# EAGLE schematic V01 (EAGLE 8.0.0)
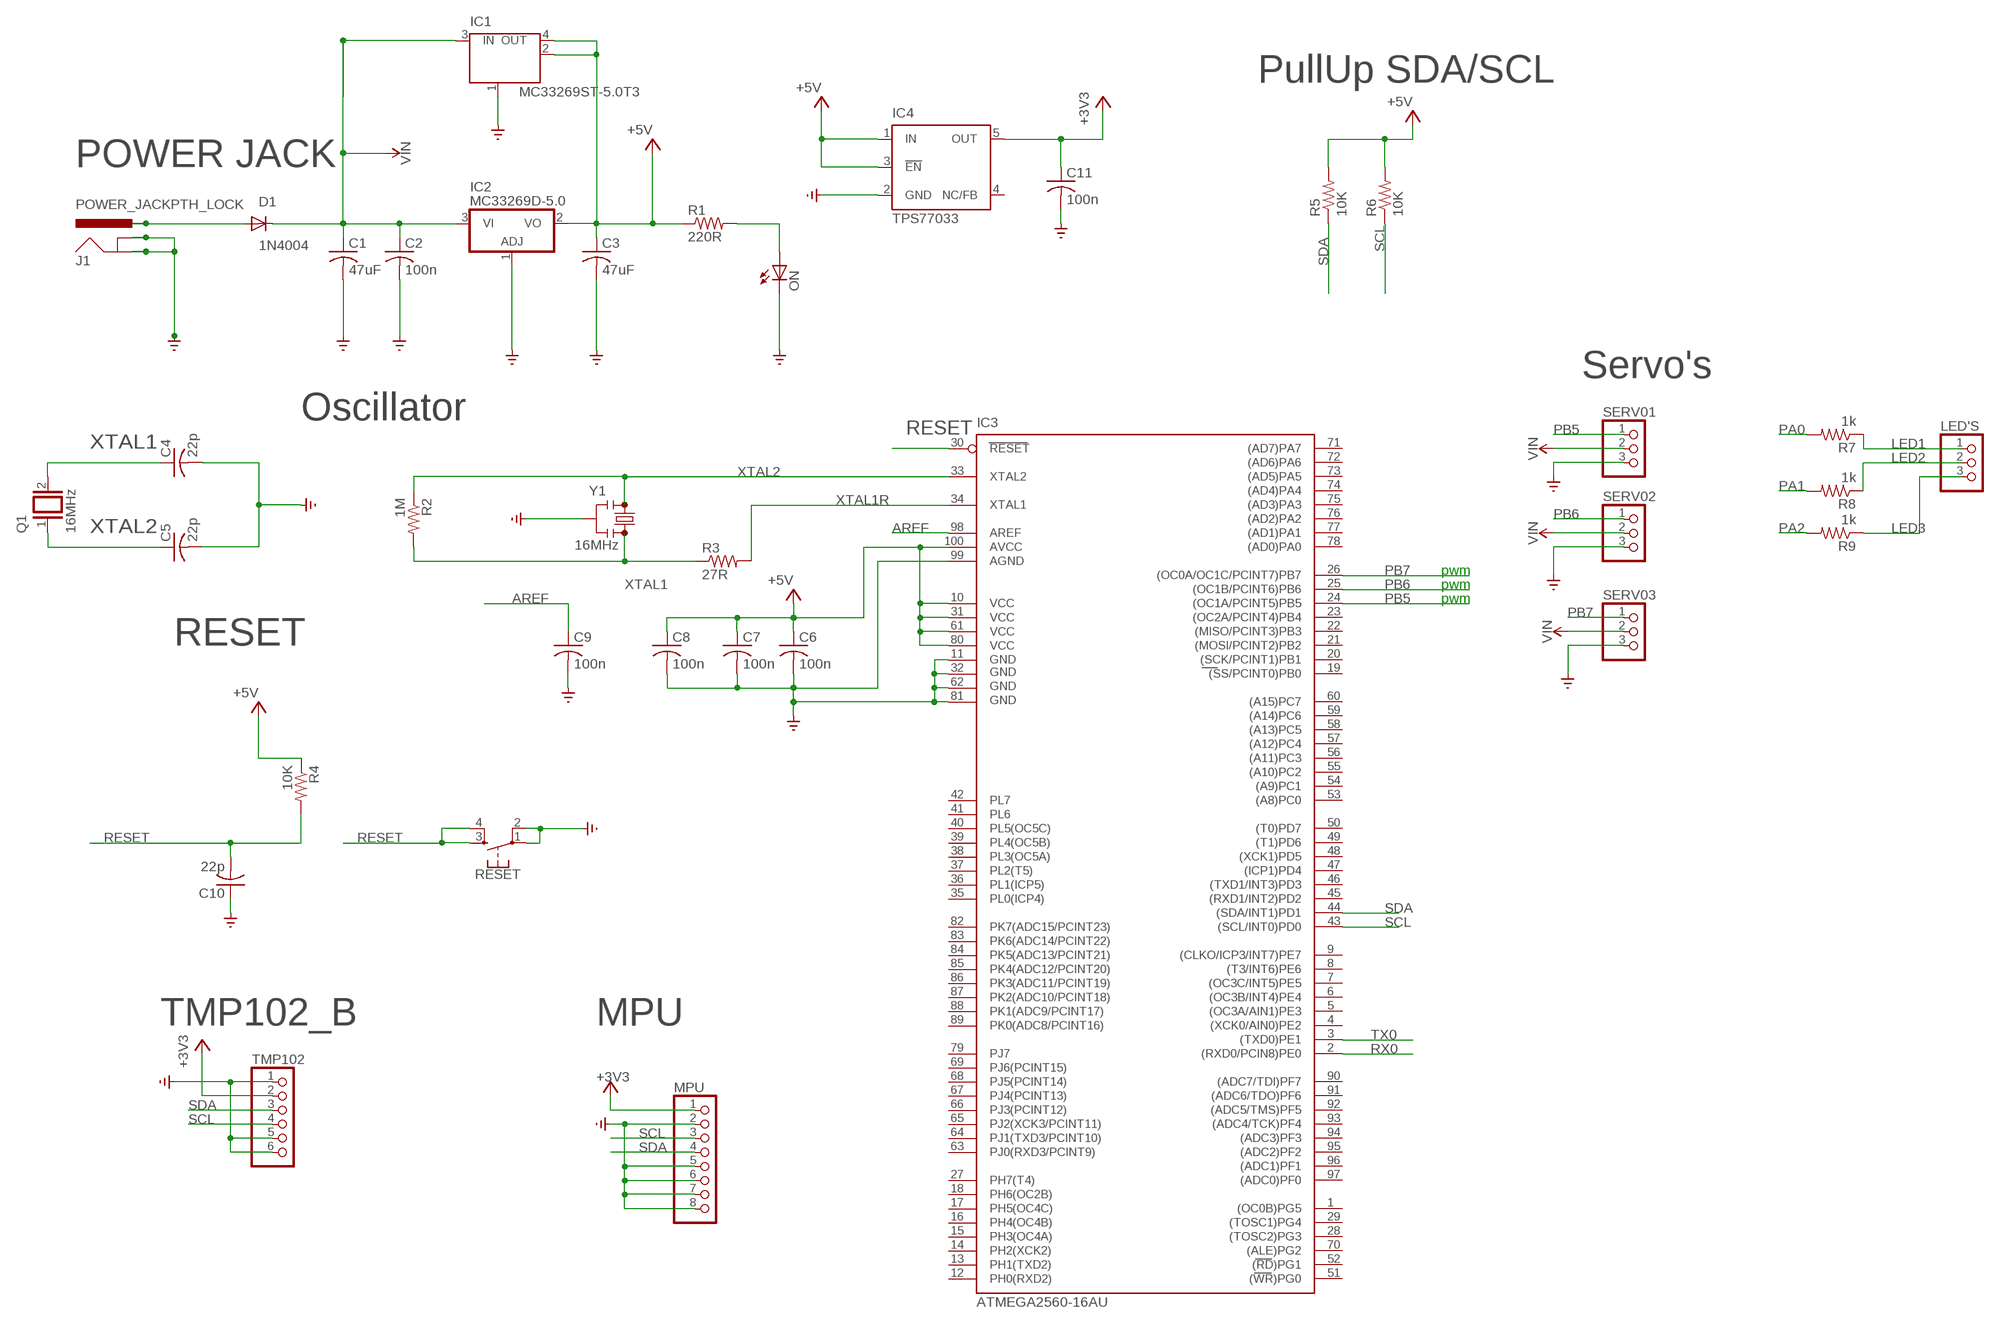
[diagram p0: schematic, sheet 1]

## Parts
C1  47uF  C-US025-024X044  [C025-024X044]
C2  100n  C-US025-024X044  [C025-024X044]
C3  47uF  C-US025-024X044  [C025-024X044]
C4  22p  C-US025-024X044  [C025-024X044]
C5  22p  C-US025-024X044  [C025-024X044]
C6  100n  C-US025-024X044  [C025-024X044]
C7  100n  C-US025-024X044  [C025-024X044]
C8  100n  C-US025-024X044  [C025-024X044]
C9  100n  C-US025-024X044  [C025-024X044]
C10  22p  C-US025-024X044  [C025-024X044]
C11  100n  C-US025-024X044  [C025-024X044]
D1  1N4004  [DO41-10]
IC1  MC33269ST-5.0T3  MC33269ST-3.3T3  [SOT223]
IC2  MC33269D-5.0  [DPACK]
IC3  ATMEGA2560-16AU  [TQFP100]
IC4  TPS77033  [SOT23-DBV]
J1  POWER_JACKPTH_LOCK  [POWER_JACK_PTH_LOCK]
LED'S  PINHD-1X3  [1X03]
MPU  PINHD-1X8  [1X08]
ON  LED3MM  [LED3MM]
Q1  16MHz  XTAL/S  [QS]
R1  220R  R-US_0204/2V  [0204V]
R2  1M  R-US_0204/2V  [0204V]
R3  27R  R-US_0204/2V  [0204V]
R4  10K  R-US_0204/2V  [0204V]
R5  10K  R-US_0204/2V  [0204V]
R6  10K  R-US_0204/2V  [0204V]
R7  1k  R-US_0204/2V  [0204V]
R8  1k  R-US_0204/2V  [0204V]
R9  1k  R-US_0204/2V  [0204V]
RESET  MOMENTARY-SWITCH-SPST-2-SMD-5.2MM  [TACTILE_SWITCH_SMD_5.2MM]
SERV01  PINHD-1X3  [1X03]
SERV02  PINHD-1X3  [1X03]
SERV03  PINHD-1X3  [1X03]
TMP102  PINHD-1X6  [1X06]
Y1  16MHz  RESONATORSMD-3.2X1.3  [RESONATOR-SMD-3.2X1.3]

## Nets
+3V3: C11.1 IC4.5(OUT) MPU.1 TMP102.2
+5V: C3.1 C6.1 C7.1 C8.1 IC1.2(OUT) IC1.4(OUT) IC2.2(VO) IC3.10(VCC) IC3.31(VCC1) IC3.61(VCC2) IC3.80(VCC3) IC3.100(AVCC) IC4.1(IN) IC4.3(!EN) R1.1 R4.1 R5.2 R6.2
AREF: C9.1 IC3.98(AREF)
GND: C1.2 C2.2 C3.2 C4.2 C5.2 C6.2 C7.2 C8.2 C9.2 C10.1 C11.2 IC1.1(GND/ADJ) IC2.1(ADJ) IC3.11(GND) IC3.32(GND1) IC3.62(GND2) IC3.81(GND3) IC3.99(AGND) IC4.2(GND) J1.GND J1.GNDBREAK MPU.2 MPU.5 MPU.6 MPU.7 MPU.8 ON.K(C) RESET.1 RESET.2 SERV01.3 SERV02.3 SERV03.3 TMP102.1 TMP102.5 TMP102.6 Y1.2 ; supply symbol labelled GND_
LED1: LED'S.1 R7.1
LED2: LED'S.2 R8.1
LED3: LED'S.3 R9.1
N$1: D1.A J1.PWR
N$3: ON.A R1.2
PA0: R7.2
PA1: R8.2
PA2: R9.2
PB5: IC3.24((OC1A/PCINT5)PB5) SERV01.1
PB6: IC3.25((OC1B/PCINT6)PB6) SERV02.1
PB7: IC3.26((OC0A/OC1C/PCINT7)PB7) SERV03.1
RESET: C10.2 IC3.30(RESET) R4.2 RESET.3 RESET.4
RX0: IC3.2((RXD0/PCIN8)PE0)
SCL: IC3.43((SCL/INT0)PD0) MPU.3 R6.1 TMP102.4
SDA: IC3.44((SDA/INT1)PD1) MPU.4 R5.1 TMP102.3
TX0: IC3.3((TXD0)PE1)
VIN: C1.1 C2.1 D1.C IC1.3(IN) IC2.3(VI) SERV01.2 SERV02.2 SERV03.2
XTAL1: C4.1 Q1.2 R2.2 R3.1 Y1.3
XTAL1R: IC3.34(XTAL1) R3.2
XTAL2: C5.1 IC3.33(XTAL2) Q1.1 R2.1 Y1.1
Unconnected: IC3.1((OC0B)PG5) IC3.4((XCK0/AIN0)PE2) IC3.5((OC3A/AIN1)PE3) IC3.6((OC3B/INT4)PE4) IC3.7((OC3C/INT5)PE5) IC3.8((T3/INT6)PE6) IC3.9((CLKO/ICP3/INT7)PE7) IC3.12(PH0(RXD2)) IC3.13(PH1(TXD2)) IC3.14(PH2(XCK2)) IC3.15(PH3(OC4A)) IC3.16(PH4(OC4B)) IC3.17(PH5(OC4C)) IC3.18(PH6(OC2B)) IC3.19((SS/PCINT0)PB0) IC3.20((SCK/PCINT1)PB1) IC3.21((MOSI/PCINT2)PB2) IC3.22((MISO/PCINT3)PB3) IC3.23((OC2A/PCINT4)PB4) IC3.27(PH7(T4)) IC3.28((TOSC2)PG3) IC3.29((TOSC1)PG4) IC3.35(PL0(ICP4)) IC3.36(PL1(ICP5)) IC3.37(PL2(T5)) IC3.38(PL3(OC5A)) IC3.39(PL4(OC5B)) IC3.40(PL5(OC5C)) IC3.41(PL6) IC3.42(PL7) IC3.45((RXD1/INT2)PD2) IC3.46((TXD1/INT3)PD3) IC3.47((ICP1)PD4) IC3.48((XCK1)PD5) IC3.49((T1)PD6) IC3.50((T0)PD7) IC3.51((WR)PG0) IC3.52((RD)PG1) IC3.53((A8)PC0) IC3.54((A9)PC1) IC3.55((A10)PC2) IC3.56((A11)PC3) IC3.57((A12)PC4) IC3.58((A13)PC5) IC3.59((A14)PC6) IC3.60((A15)PC7) IC3.63(PJ0(RXD3/PCINT9)) IC3.64(PJ1(TXD3/PCINT10)) IC3.65(PJ2(XCK3/PCINT11)) IC3.66(PJ3(PCINT12)) IC3.67(PJ4(PCINT13)) IC3.68(PJ5(PCINT14)) IC3.69(PJ6(PCINT15)) IC3.70((ALE)PG2) IC3.71((AD7)PA7) IC3.72((AD6)PA6) IC3.73((AD5)PA5) IC3.74((AD4)PA4) IC3.75((AD3)PA3) IC3.76((AD2)PA2) IC3.77((AD1)PA1) IC3.78((AD0)PA0) IC3.79(PJ7) IC3.82(PK7(ADC15/PCINT23)) IC3.83(PK6(ADC14/PCINT22)) IC3.84(PK5(ADC13/PCINT21)) IC3.85(PK4(ADC12/PCINT20)) IC3.86(PK3(ADC11/PCINT19)) IC3.87(PK2(ADC10/PCINT18)) IC3.88(PK1(ADC9/PCINT17)) IC3.89(PK0(ADC8/PCINT16)) IC3.90((ADC7/TDI)PF7) IC3.91((ADC6/TDO)PF6) IC3.92((ADC5/TMS)PF5) IC3.93((ADC4/TCK)PF4) IC3.94((ADC3)PF3) IC3.95((ADC2)PF2) IC3.96((ADC1)PF1) IC3.97((ADC0)PF0) IC4.4(NC/FB)

## Notes on the sheet
- PullUp SDA/SCL
- POWER JACK
- Servo's
- Oscillator
- pwm
- pwm
- pwm
- RESET
- TMP102_B | MPU

## Library data of the parts
C1-C11 = adafruit:C-US: CAPACITOR, American symbol
D1 = adafruit:1N4004: DIODE General purpose 1N400x type rectifier (With bigger pads) http://www.ladyada.net/library/pcb/eaglelibrary.html
IC1 = linear:MC33269ST*: Adjustable Output Low Dropout Voltage Regulator 800 mA Source: http://www.onsemi.com/pub/Collateral/MC33269-D.PDF
IC2 = linear:MC33269?*: Adjustable Output Low Dropout Voltage Regulator 800 mA Source: http://www.onsemi.com/pub/Collateral/MC33269-D.PDF
IC3 = atmel-2005:ATMEGA*: MICROCONTROLLER 64/128/256 Kbytes FLASH 4 Kbytes EEPROM 8 Kbytes SRAM 86 General Purpose I/O pins 12-channels16-bit PWM 4 x Serial USARTs 16-channels 10-bit A/D
IC4 = texas:TPS770*: ULTRALOW-POWER 50-mA LOW-DROPOUT LINEAR REGULATORS 50-mA Low-Dropout Regulator Source: http://focus.ti.com/lit/ds/symlink/tps77001.pdf; MF: TEXAS INSTRUMENTS; MPN: TPS77033DBVT; OC_FARNELL: 8461570; OC_NEWARK: 77C1187
J1 = SparkFun-Connectors:POWER_JACK: Power Jack Connector This is the standard 5.5mm barrel jack for power. The PTH is the most common, proven, reliable, footprint. The Slot footprint only works if the mill layer is transmitted to the PCB fab house so be warned. Here are the connectors we sell at SparkFun: DC Barrel Power Jack/Connector <https://www.sparkfun.com/products/119> (PRT-00119) DC Barrel Power Jack/Connector (SMD) <https://www.sparkfun.com/products/12748> (PRT-12748) DC Barrel Jack Adapter - Breadboard Compatible <https://www.sparkfun.com/products/10811> (PRT-10811) It is used on this SparkFun product (and many, many others): SparkFun RedBoard - Programmed with Arduino <https://www.sparkfun.com/products/12757> (DEV-12757) Also, if you need a mating power supply or connector, please check these out: Wall Adapter Power Supply - 9VDC 650mA <https://www.sparkfun.com/products/298> (TOL-00298) DC Barrel Jack Adapter - Male <https://www.sparkfun.com/products/10287> (PRT-10287); PROD_ID: CONN-08197; SF_ID: PRT-00119
LED'S SERV01-SERV03 = pinhead:PINHD-1X3: PIN HEADER
MPU = pinhead:PINHD-1X8: PIN HEADER
ON = adafruit:LED: LED OSRAM: - CHIPLED LG R971, LG N971, LY N971, LG Q971, LY Q971, LO R971, LY R971 LH N974, LH R974 LS Q976, LO Q976, LY Q976 LO Q996 - Hyper CHIPLED LW Q18S LB Q993, LB Q99A, LB R99A - SideLED LS A670, LO A670, LY A670, LG A670, LP A670 LB A673, LV A673, LT A673, LW A673 LH A674 LY A675 LS A676, LA A676, LO A676, LY A676, LW A676 LS A679, LY A679, LG A679 - Hyper Micro SIDELED® LS Y876, LA Y876, LO Y876, LY Y876 LT Y87S - SmartLED LW L88C, LW L88S LB L89C, LB L89S, LG L890 LS L89K, LO L89K, LY L89K LS L896, LA L896, LO L896, LY L896 - TOPLED LS T670, LO T670, LY T670, LG T670, LP T670 LSG T670, LSP T670, LSY T670, LOP T670, LYG T670 LG T671, LOG T671, LSG T671 LB T673, LV T673, LT T673, LW T673 LH T674 LS T676, LA T676, LO T676, LY T676, LB T676, LH T676, LSB T676, LW T676 LB T67C, LV T67C, LT T67C, LS T67K, LO T67K, LY T67K, LW E67C LS E67B, LA E67B, LO E67B, LY E67B, LB E67C, LV E67C, LT E67C LW T67C LS T679, LY T679, LG T679 LS T770, LO T770, LY T770, LG T770, LP T770 LB T773, LV T773, LT T773, LW T773 LH T774 LS E675, LA E675, LY E675, LS T675 LS T776, LA T776, LO T776, LY T776, LB T776 LHGB T686 LT T68C, LB T68C - Hyper Mini TOPLED® LB M676 - Mini TOPLED Santana® LG M470 LS M47K, LO M47K, LY M47K Source: http://www.osram.convergy.de/
Q1 = special:XTAL/S: CRYSTAL
R1-R9 = resistor:R-US_: RESISTOR, American symbol
RESET = SparkFun-Switches:MOMENTARY-SWITCH-SPST-2: Momentary Switch (Pushbutton) - SPST - Two Circuits Normally-open (NO) SPST momentary switches (buttons, pushbuttons). Schematic symbol includes two switch circuits. Variants SMD-4.6MMX2.8MM - 4.60mm x 2.80mm Tactile Momentary Button Switch - Used on SparkFun SAMD21 Mini Breakout <https://www.sparkfun.com/products/13664> SMD-5.2MM - Mini Pushbutton Switch - SMD <https://www.sparkfun.com/products/8720> - Used on Arduino Pro Mini <https://www.sparkfun.com/products/11114>; PROD_ID: SWCH-08247; SF_SKU: COM-08720
TMP102 = pinhead:PINHD-1X6: PIN HEADER
Y1 = SparkFun-Clocks:RESONATOR: Resonators (Generic) Ceramic resonators are clock-generating components, often used to control timing in microcontrollers. They usually have 3 pins: two pins for oscillation, and one pin for ground. Compared to crystals, resonators have worse tolerance, but are usually much cheaper. Plus, they have built-in load capacitors! These devices are used on boards like the Arduino Pro 8MHz <https://www.sparkfun.com/products/11114> and Arduino Pro 16MHz <https://www.sparkfun.com/products/11113>.